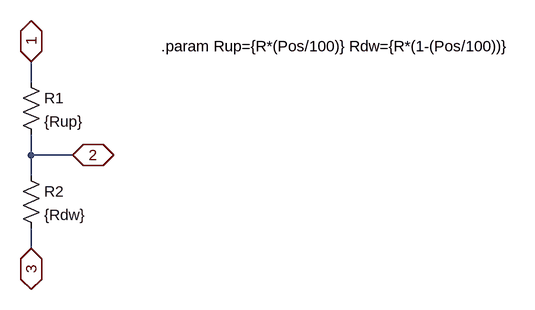
[diagram p0: schematic Potentiometer.asc]
Potentiometer.asc, the LTspice schematic file:
Version 4.1
SHEET 1 948 680
WIRE 112 80 112 48
WIRE 112 192 112 160
WIRE 176 192 112 192
WIRE 112 224 112 192
WIRE 112 336 112 304
FLAG 112 48 1
IOPIN 112 48 BiDir
FLAG 112 336 3
IOPIN 112 336 BiDir
FLAG 176 192 2
IOPIN 176 192 BiDir
SYMBOL res 96 64 R0
SYMATTR InstName R1
SYMATTR Value {Rup}
SYMBOL res 96 208 R0
SYMATTR InstName R2
SYMATTR Value {Rdw}
TEXT 312 24 Left 2 !.param Rup={R*(Pos/100)} Rdw={R*(1-(Pos/100))}

The netlist it stands for:
* Potentiometer.asc
R1 1 2 {Rup}
R2 2 3 {Rdw}
.param Rup={R*(Pos/100)} Rdw={R*(1-(Pos/100))}
.backanno
.end